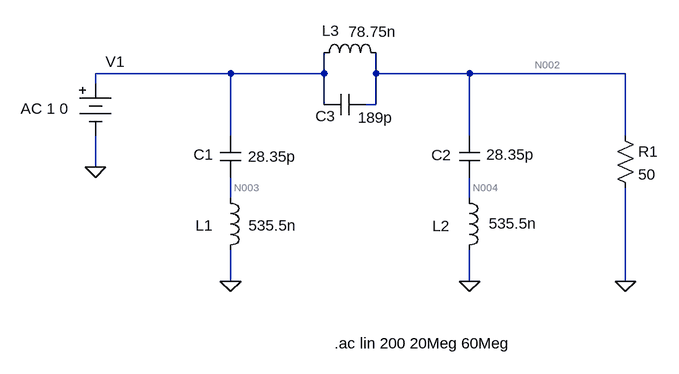
[diagram p0: schematic Filter v3 - v2 tolerance test.asc]
Filter v3 - v2 tolerance test.asc, the LTspice schematic file:
Version 4
SHEET 1 880 680
WIRE 160 16 -48 16
WIRE 304 16 304 -16
WIRE 304 16 160 16
WIRE 384 16 384 -16
WIRE 528 16 384 16
WIRE 768 16 528 16
WIRE -48 32 -48 16
WIRE 304 64 304 16
WIRE 384 64 384 16
WIRE 384 64 368 64
WIRE 160 112 160 16
WIRE 528 112 528 16
WIRE 768 112 768 16
WIRE -48 160 -48 112
WIRE 160 208 160 176
WIRE 528 208 528 176
WIRE 160 336 160 288
WIRE 528 336 528 288
WIRE 768 336 768 192
FLAG 160 336 0
FLAG 528 336 0
FLAG -48 160 0
FLAG 768 336 0
SYMBOL cap 144 112 R0
WINDOW 0 -41 29 Left 2
WINDOW 3 43 32 Left 2
SYMATTR InstName C1
SYMATTR Value 28.35p
SYMBOL ind 144 192 R0
WINDOW 0 -38 58 Left 2
WINDOW 3 44 58 Left 2
SYMATTR InstName L1
SYMATTR Value 535.5n
SYMBOL ind 512 192 R0
WINDOW 0 -41 59 Left 2
WINDOW 3 46 55 Left 2
SYMATTR InstName L2
SYMATTR Value 535.5n
SYMBOL cap 512 112 R0
WINDOW 0 -43 30 Left 2
WINDOW 3 42 29 Left 2
SYMATTR InstName C2
SYMATTR Value 28.35p
SYMBOL cap 368 48 R90
WINDOW 0 49 62 VBottom 2
WINDOW 3 20 -15 VTop 2
SYMATTR InstName C3
SYMATTR Value 189p
SYMBOL ind 288 0 R270
WINDOW 0 34 26 VTop 2
WINDOW 3 64 91 VBottom 2
SYMATTR InstName L3
SYMATTR Value 78.75n
SYMBOL Misc\\battery -48 16 R0
WINDOW 0 16 -18 Left 2
WINDOW 123 -115 54 Left 2
WINDOW 39 0 0 Left 0
SYMATTR InstName V1
SYMATTR Value2 AC 1 0
SYMATTR Value ""
SYMBOL res 752 96 R0
SYMATTR InstName R1
SYMATTR Value 50
TEXT 320 432 Left 2 !.ac lin 200 20Meg 60Meg

The netlist it stands for:
* Filter v3 - v2 tolerance test.asc
C1 N001 N003 28.35p
L1 N003 0 535.5n
L2 N004 0 535.5n
C2 N002 N004 28.35p
C3 N002 N001 189p
L3 N001 N002 78.75n
V1 N001 0 AC 1 0
R1 N002 0 50
.ac lin 200 20Meg 60Meg
.backanno
.end

* Results of the author's LTspice run, read from the files saved beside the schematic
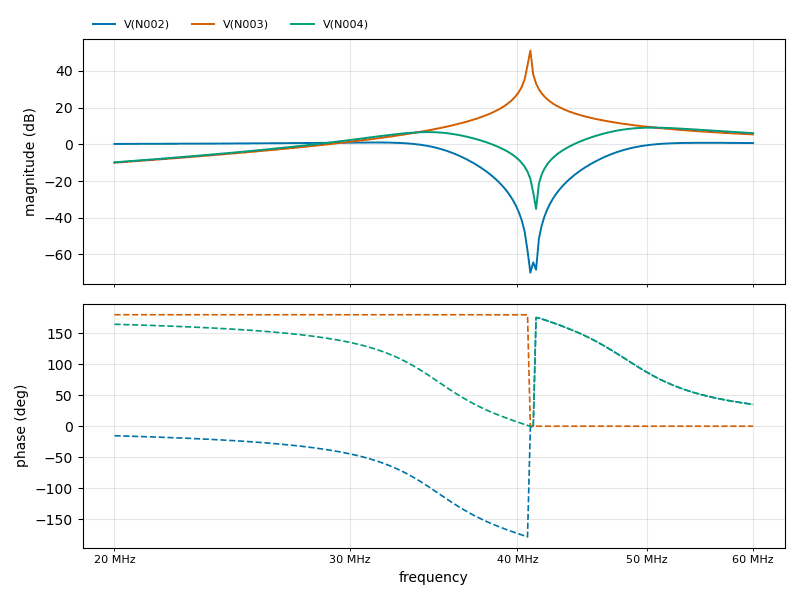
[diagram p1: AC Analysis of Filter v3 - v2 tolerance test.asc, plotted from the saved traces]
* AC Analysis, 1 run:
*   V(N002): 0.23 dB at 20 MHz, 0.69 dB at 60 MHz, peak 1.03 dB at 31.06 MHz, 3 dB below the peak at 34.83 MHz
*   V(N003): -10.02 dB at 20 MHz, 5.41 dB at 60 MHz, peak 51.08 dB at 40.9 MHz, 3 dB below the peak at 40.83 MHz and 40.95 MHz
*   V(N004): -9.80 dB at 20 MHz, 6.10 dB at 60 MHz, peak 9.11 dB at 50.35 MHz, 3 dB below the peak at 46.55 MHz